# Altium schematic sheet sensor10DOF-S.SchDoc
size A
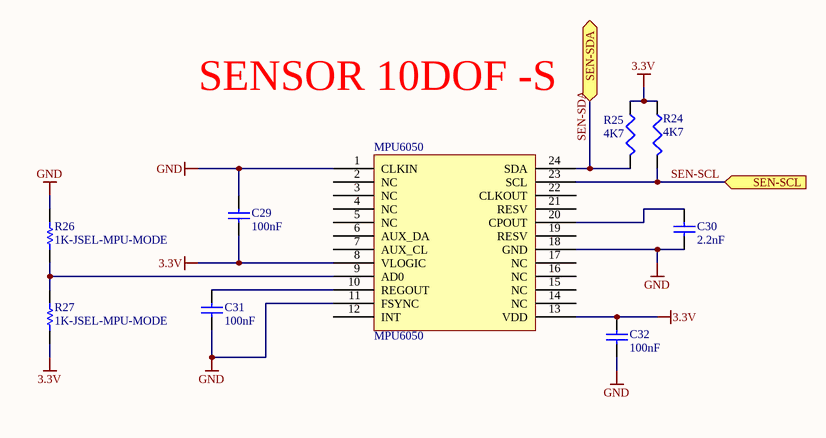
[diagram p0: sensor10DOF-S.SchDoc]

## Parts
C29  100nF  [2012[0805]]
C30  2.2nF  [2012[0805]]
C31  100nF  [2012[0805]]
C32  100nF  [2012[0805]]
MPU6050  MPU6050  [QFN_36]
R24  4K7  [2012[0805]]
R25  4K7  [2012[0805]]
R26  1K-JSEL-MPU-MODE  [2012[0805]]
R27  1K-JSEL-MPU-MODE  [2012[0805]]

## Ports
SEN-SCL (in), SEN-SDA

## Nets
3.3V: C29.1 C32.2 MPU6050.8(VLOGIC) MPU6050.13(VDD) R24.1 R25.1 R27.1
GND: C29.2 C30.1 C31.1 C32.1 MPU6050.1(CLKIN) MPU6050.11(FSYNC) MPU6050.18(GND) R26.2
SEN-SCL: MPU6050.23(SCL) R24.2 ; port SEN-SCL
SEN-SDA: MPU6050.24(SDA) R25.2 ; port SEN-SDA
NetC30_2: C30.2 MPU6050.20(CPOUT)
NetC31_2: C31.2 MPU6050.10(REGOUT)
NetMPU6050_9: MPU6050.9(AD0) R26.1 R27.2

Not connected (* = marked no-connect by the designer): MPU6050 2(NC) 3(NC) 4(NC) 5(NC) 6(AUX_DA) 7(AUX_CL) 12(INT) 14(NC) 15(NC) 16(NC) 17(NC) 19(RESV) 21(RESV) 22(CLKOUT)

## Notes on the sheet
- SENSOR 10DOF -S

## Library data of the parts
C29 C31 C32 = Cap: Capacitor; Published: 8-Jun-2000; LatestRevisionDate: 17-Jul-2002; LatestRevisionNote: Re-released for DXP Platform.; PackageReference: RAD-0.3; Publisher: Altium Limited; Value: 100nF
C30 = Cap: Capacitor; Value: 100nF; Published: 8-Jun-2000; LatestRevisionDate: 17-Jul-2002; LatestRevisionNote: Re-released for DXP Platform.; PackageReference: RAD-0.3; Publisher: Altium Limited
R24 R25 = Res3: Resistor; Value: 10K; Published: 8-Jun-2000; LatestRevisionDate: 04-Mar-2005; LatestRevisionNote: PCB Footprint replaced.; PackageReference: J1-0603; Publisher: Altium Limited
R26 R27 = Res1: Resistor; Value: 1K; Published: 8-Jun-2000; LatestRevisionDate: 17-Jul-2002; LatestRevisionNote: Re-released for DXP Platform.; PackageReference: AXIAL-0.3; Publisher: Altium Limited